# EAGLE design mainboard_hole_din_pa1 (EAGLE 4.11)
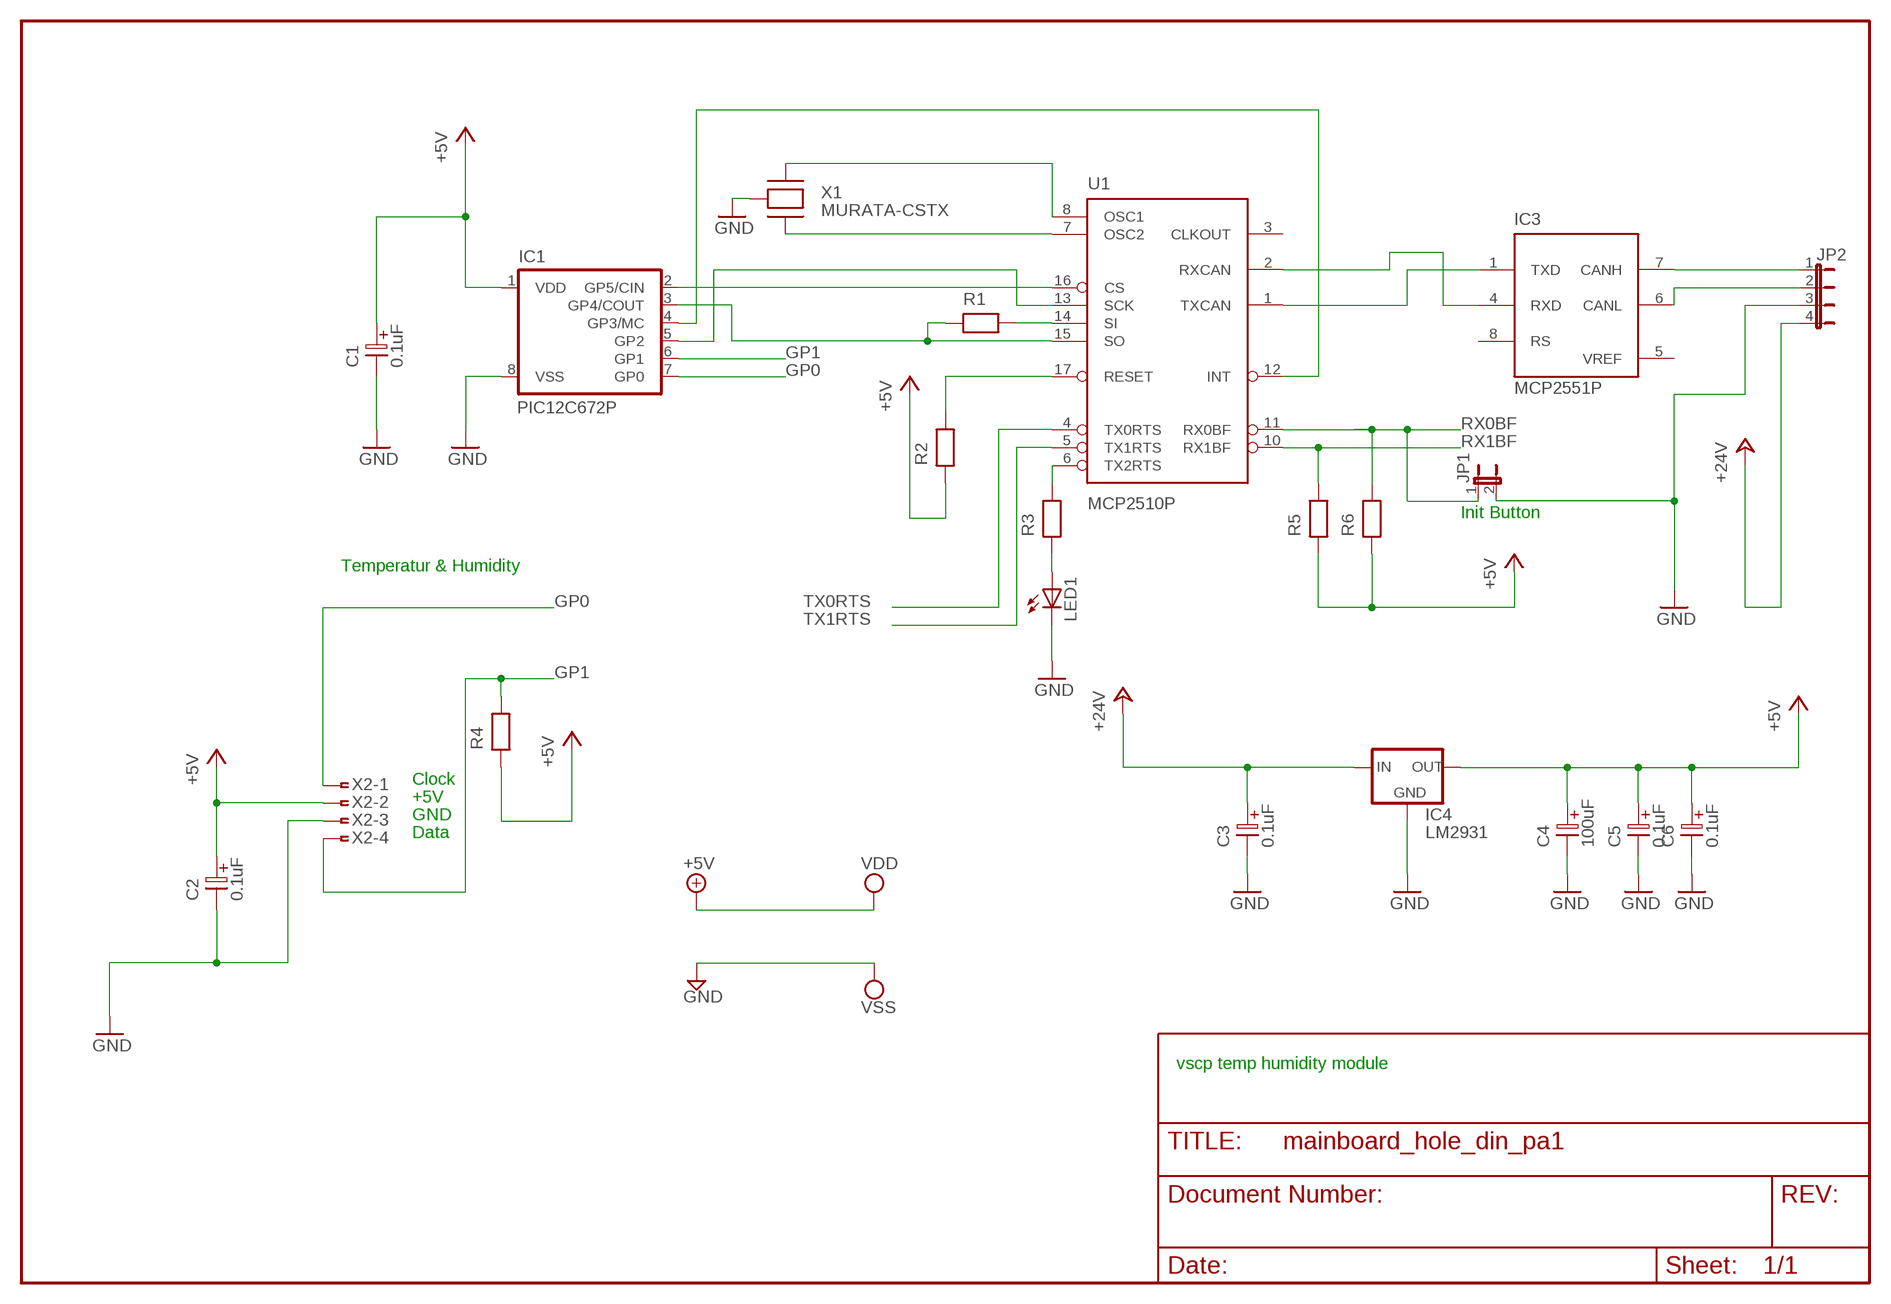
[diagram p0: schematic, sheet 1]

## Parts
C1  0.1uF  ELC-2,5  [ES-2,5]
C2  0.1uF  ELC-2,5  [ES-2,5]
C3  0.1uF  ELC-2,5  [ES-2,5]
C4  100uF  ELC-5  [ES-5]
C5  0.1uF  ELC-2,5  [ES-2,5]
C6  0.1uF  ELC-2,5  [ES-2,5]
IC1  PIC12C672P  [DIL8]
IC3  MCP2551P  [DIL8]
IC4  LM2931  78LXX  [78LXX]
JP1  JP1E  [JP1]
JP2  JP4E  [JP4]
LED1  LED3MM  [LED3MM]
R1  RESEU-5  [R-5]
R2  RESEU-5  [R-5]
R3  RESEU-5  [R-5]
R4  RESEU-5  [R-5]
R5  RESEU-5  [R-5]
R6  RESEU-5  [R-5]
U1  MCP2510P  [DIL18]
X1  MURATA-CSTX  [RESONATOR-MURATA]
X2  FTOP-4  [FTOP-4]

## Nets
+5V: C1.1 C2.1 C4.1 C5.1 C6.1 IC1.1(VDD) IC4.OUT R2.1 R4.1 R5.1 R6.1 X2.2 ; supply symbol labelled VDD
+24V: C3.1 IC4.IN JP2.4
CANH: IC3.7(CANH) JP2.1
CANL: IC3.6(CANL) JP2.2
GND: C1.2 C2.2 C3.2 C4.2 C5.2 C6.2 IC1.8(VSS) IC4.GND JP1.2 JP2.3 LED1.K(C) X1.2(GND) X2.3 ; supply symbol labelled VSS
GP0: IC1.7(GP0) X2.1
GP1: IC1.6(GP1) R4.2 X2.4
GP2: IC1.5(GP2) U1.13(SCK)
GP3: IC1.4(GP3/MC) U1.12(INT)
GP4: IC1.3(GP4/COUT) R1.1 U1.15(SO)
GP5: IC1.2(GP5/CIN) U1.16(CS)
N$3: R2.2 U1.17(RESET)
N$7: R1.2 U1.14(SI)
N$10: LED1.A R3.1
OSC1: U1.8(OSC1) X1.1(XTIN)
OSC2: U1.7(OSC2) X1.3(XTOUT)
RX0BF: JP1.1 R6.2 U1.11(RX0BF)
RX1BF: R5.2 U1.10(RX1BF)
RXCAN: IC3.4(RXD) U1.2(RXCAN)
TX0RTS: U1.4(TX0RTS)
TX1RTS: U1.5(TX1RTS)
TX2RTS: R3.2 U1.6(TX2RTS)
TXCAN: IC3.1(TXD) U1.1(TXCAN)
Unconnected: IC3.8(RS) U1.3(CLKOUT)

## Notes on the sheet
- Init Button
- Temperatur & Humidity
- Clock
- +5V
- GND
- Data
- vscp temp humidity module

## Power pins joined to a net without a drawn wire
+5V: IC3.3(VDD) U1.18(VDD)
GND: IC3.2(VSS) U1.9(VSS)
VREF: IC3.5(VREF)

## Library data of the parts
C1-C3 C5 C6 = discrete:ELC-2,5
C4 = discrete:ELC-5
IC1 = microchip:PIC12C*?: MICROCONTROLLER
IC3 = microchip_can:MCP2551: High Speed CAN tranceiver
IC4 = v-reg:78LXX: VOLTAGE REGULATOR
JP1 = jumper:JP1E: JUMPER
JP2 = jumper:JP4E: JUMPER
LED1 = led:LED: LED OSRAM: - CHIPLED LG R971, LG N971, LY N971, LG Q971, LY Q971, LO R971, LY R971 LH N974, LH R974 LS Q976, LO Q976, LY Q976 LO Q996 - Hyper CHIPLED LW Q18S LB Q993, LB Q99A, LB R99A - SideLED LS A670, LO A670, LY A670, LG A670, LP A670 LB A673, LV A673, LT A673, LW A673 LH A674 LY A675 LS A676, LA A676, LO A676, LY A676, LW A676 LS A679, LY A679, LG A679 - Hyper Micro SIDELED® LS Y876, LA Y876, LO Y876, LY Y876 LT Y87S - SmartLED LW L88C, LW L88S LB L89C, LB L89S, LG L890 LS L89K, LO L89K, LY L89K LS L896, LA L896, LO L896, LY L896 - TOPLED LS T670, LO T670, LY T670, LG T670, LP T670 LSG T670, LSP T670, LSY T670, LOP T670, LYG T670 LG T671, LOG T671, LSG T671 LB T673, LV T673, LT T673, LW T673 LH T674 LS T676, LA T676, LO T676, LY T676, LB T676, LH T676, LSB T676, LW T676 LB T67C, LV T67C, LT T67C, LS T67K, LO T67K, LY T67K, LW E67C LS E67B, LA E67B, LO E67B, LY E67B, LB E67C, LV E67C, LT E67C LW T67C LS T679, LY T679, LG T679 LS T770, LO T770, LY T770, LG T770, LP T770 LB T773, LV T773, LT T773, LW T773 LH T774 LS E675, LA E675, LY E675, LS T675 LS T776, LA T776, LO T776, LY T776, LB T776 LHGB T686 LT T68C, LB T68C - Hyper Mini TOPLED® LB M676 - Mini TOPLED Santana® LG M470 LS M47K, LO M47K, LY M47K Source: http://www.osram.convergy.de/
R1-R6 = discrete:RESEU-5
U1 = microchip_can:MCP2510
X1 = eurosource_ftdi:MURATA-CSTX
X2 = con-amp:FTOP-4: AMP connector

## Board
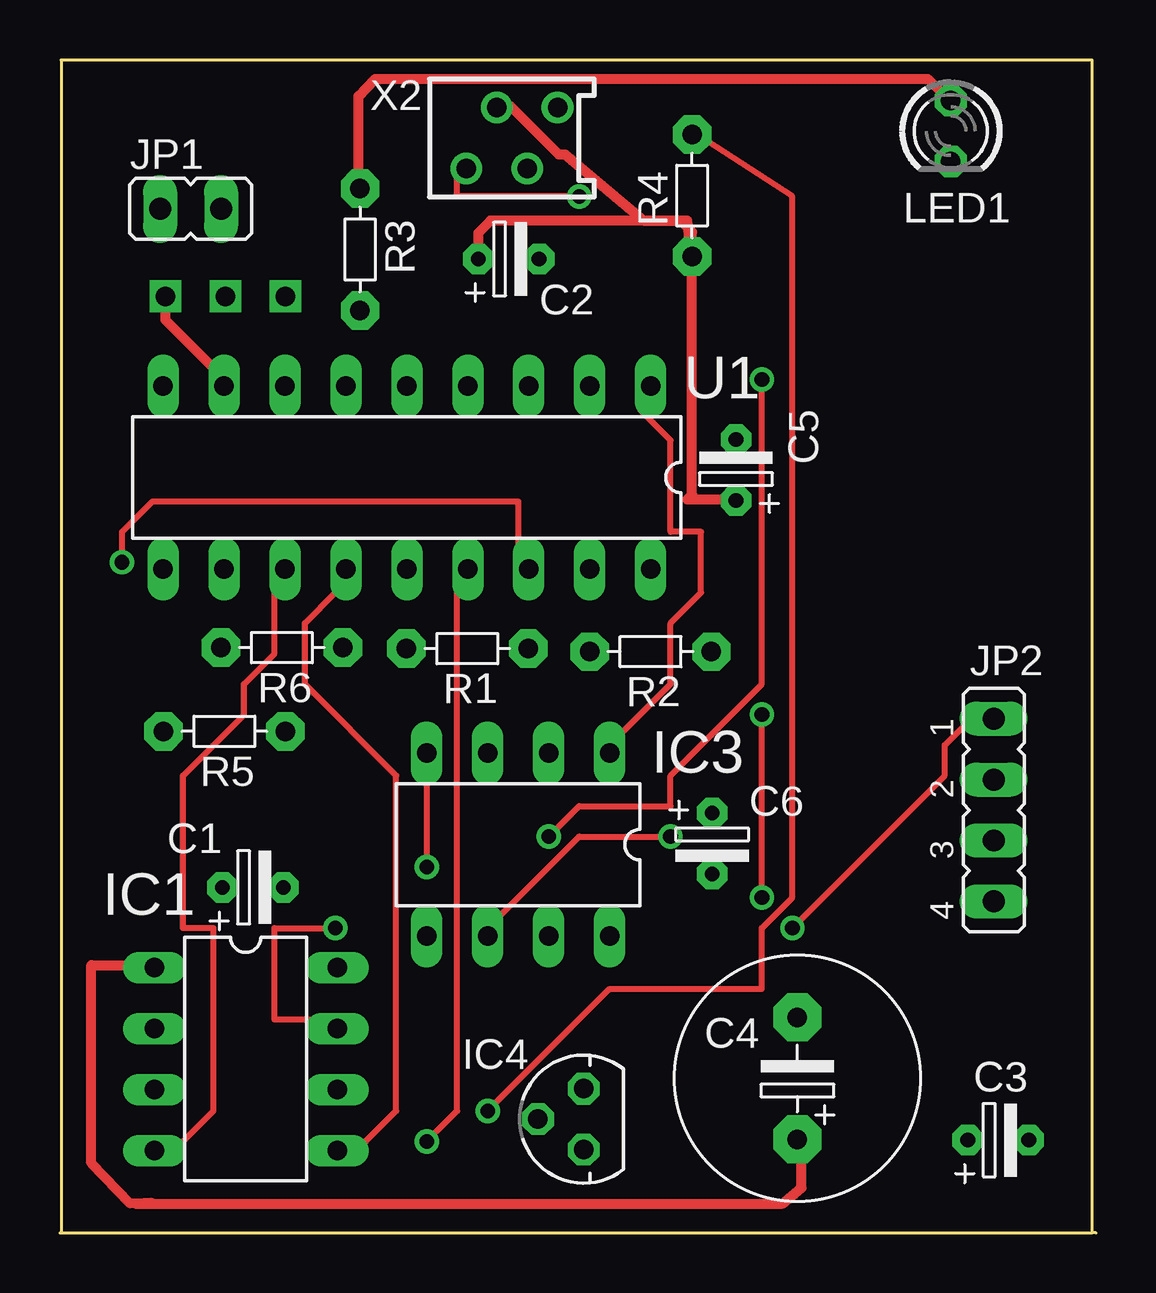
[diagram p1: board, top side]
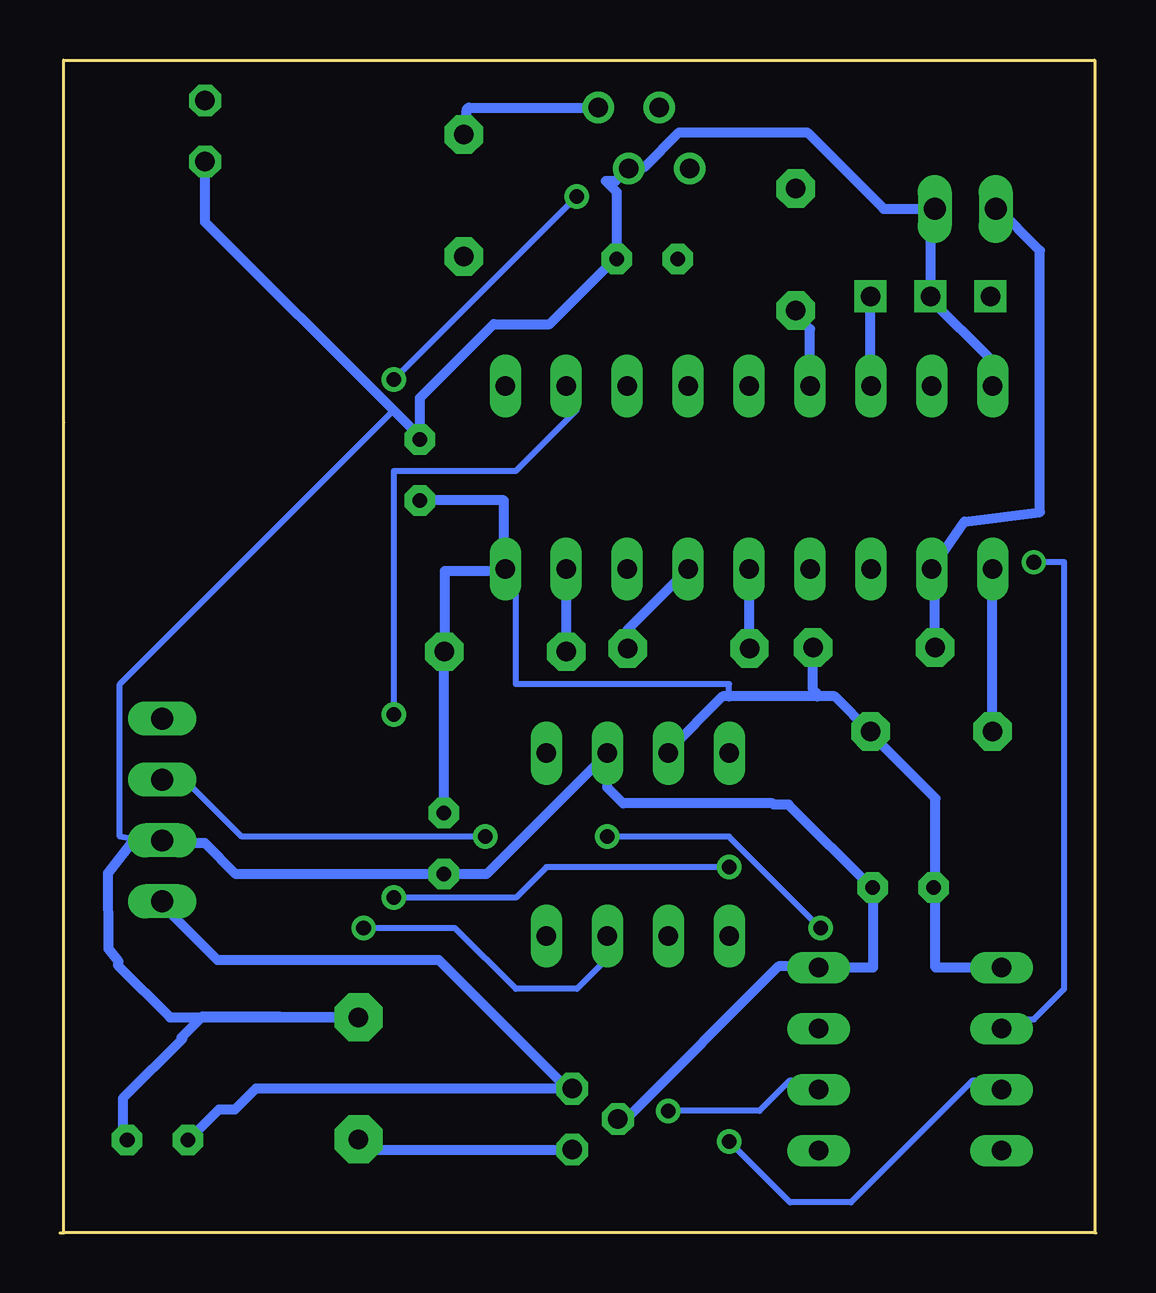
[diagram p2: board, bottom side, seen from below]

Size 43.18 x 48.87 mm. Coordinates in mm from the lower left corner, seen from the top.
Copper layers (1*16): Top 0.0254mm / dielectric 1.4986mm / Bottom 0.0254mm
Design rules "default": minimum track width 10mil, minimum drill 24mil, track to track 8mil, track to pad 8mil, pad to pad 8mil, via to via 8mil, smd to smd 8mil, copper to edge 40mil, drill to drill 8mil, minimum pad ring 10mil, minimum via ring 8mil, stop-mask expansion 4mil, vias tented up to drill 0mil, thermal gap 10mil

### Footprints (pad centres in the part's own frame; a part is rotated, then mirrored left to right if it is on the bottom)
ES-2,5 = drill 0.61 pad 1.27 octagon: 1 -1.27,0; 2 1.27,0
ES-5 = drill 0.813 pad 2.007 octagon: 1 -2.54,0; 2 2.54,0
DIL8 = drill 0.813 long: 1 -3.81,-3.81; 2 -1.27,-3.81; 3 1.27,-3.81; 4 3.81,-3.81; 5 3.81,3.81; 6 1.27,3.81; 7 -1.27,3.81; 8 -3.81,3.81
78LXX = drill 0.813 octagon: GND 0,1.905; IN 1.27,0; OUT -1.27,0
JP1 = drill 0.914 long: 1 0,-1.27; 2 0,1.27
JP4 = drill 0.914 long: 1 -3.81,0; 2 -1.27,0; 3 1.27,0; 4 3.81,0
LED3MM = drill 0.813 octagon: A -1.27,0; K 1.27,0
R-5 = drill 0.813 pad 1.6 octagon: 1 -2.54,0; 2 2.54,0
DIL18 = drill 0.813 long: 1 -10.16,-3.81; 2 -7.62,-3.81; 3 -5.08,-3.81; 4 -2.54,-3.81; 5 0,-3.81; 6 2.54,-3.81; 7 5.08,-3.81; 8 7.62,-3.81; 9 10.16,-3.81; 10 10.16,3.81; 11 7.62,3.81; 12 5.08,3.81; 13 2.54,3.81; 14 0,3.81; 15 -2.54,3.81; 16 -5.08,3.81; 17 -7.62,3.81; 18 -10.16,3.81
RESONATOR-MURATA = drill 0.813 square: 1 0,0; 2 2.5,0; 3 5,0
FTOP-4 = drill 0.813 round: 1 -1.905,-1.27; 2 -0.635,1.27; 3 0.635,-1.27; 4 1.905,1.27

### Placement (x,y rotation side)
C1  8.04,14.39 0 top
C2  18.7,40.57 0 top
C3  39.11,3.86 0 top
C4  30.74,6.44 90 top
C5  28.18,31.79 90 top
C6  27.19,16.22 270 top
IC1  7.74,7.24 270 top
IC3  19.1,16.18 180 top
IC4  21.83,4.74 90 top
JP1  5.45,42.66 270 top
JP2  38.92,17.62 270 top
LED1  37.13,45.9 270 top
R1  16.98,24.35 180 top
R2  24.62,24.21 180 top
R3  12.51,40.97 270 top
R4  26.35,43.22 90 top
R5  6.86,20.89 180 top
R6  9.25,24.38 180 top
U1  14.46,31.47 180 top
U$1  [DIN_SIMPLE]  0.05,0 0 top
X1  4.4,39.02 0 top
X2  18.84,45.62 0 top

### Tracks (layer width: path | path; a pad name or v marks a point on that pad's centre or on a via)
+5V  (via drill 0.61)
  Top 0.406: v30.74,3.97 v30.74,3.96 30.91,3.79 30.91,1.87 30.12,1.22 3.15,1.22 3.82,1.25 2.91,1.24 1.31,2.9 1.31,11.15 3.99,11.15 4.04,11.1 3.99,11.05 IC1.1 | C2.1 17.43,41.66 17.95,42.17 25.57,42.17 26.14,42.17 | 26.14,42.17 26.2,41.61 R4.1 | 24.32,42.17 26.14,42.17 | 24.32,42.17 21.06,44.92 20.8,44.92 18.77,46.94 18,46.94 18.05,46.89 X2.2 | 24.32,42.17 25.88,42.17 26.35,41.7 26.35,30.76 26.14,30.55 28.06,30.55 28.16,30.45 28.18,30.46 C5.1
  Bottom 0.254: 24.68,27.57 24.18,27.94 U1.18 24.18,26.67 24.18,22.86 15.29,22.86 15.29,22.36
  Bottom 0.406: C5.1 24.68,30.52 24.68,27.57 27.14,27.57 27.14,24.21 | 27.14,24.21 27.14,24.12 | 27.14,24.21 R2.1 27.14,24.21 | 6.69,14.39 C1.1 | IC1.1 6.69,11.05 6.69,14.39 | v30.74,3.97 30.76,3.99 | v30.74,3.97 C4.1 | IC4.OUT 30.23,3.47 v30.74,3.97 | 27.14,24.21 27.13,24.22 | C6.1 27.19,24.16 27.14,24.21 | 6.69,14.39 6.69,18.1 9.44,20.85 R5.1 9.39,20.86 | IC3.3 17.83,20.09 15.56,22.36 15.29,22.36 11.62,22.36 | 9.39,20.86 9.39,20.85 | 11.62,22.36 10.89,22.36 9.39,20.86 | 11.62,22.36 11.62,22.46 11.79,22.64 R6.1
+24V
  Bottom 0.406: C3.1 37.92,3.79 | C3.1 | C3.1 36.57,5.13 35.89,5.13 35.02,6.01 IC4.IN 22.03,6.01 27.39,11.36 36.62,11.36 39.07,13.81 | 39.07,13.81 39.11,13.85 | 39.07,13.81 JP2.4
CANH  (via drill 0.61)
  Top 0.254: v30.53,12.7 36.88,19.05 36.88,20.32 38.15,21.59 JP2.1
  Bottom 0.254: v30.53,12.7 26.72,12.7 24.18,10.16 21.64,10.16 20.37,11.43 IC3.7
CANL  (via drill 0.61)
  Top 0.254: v25.45,16.51 21.64,16.51 17.83,12.7 IC3.6
  Bottom 0.254: v25.45,16.51 35.61,16.51 38.15,19.05 JP2.2
GND
  Bottom 0.254: 29.26,34.29 29.28,34.27 40.69,22.86 40.69,16.51 40.09,16.39
  Bottom 0.406: 9.28,14.39 9.28,14.52 | 9.28,14.39 C1.2 9.31,14.34 | 9.28,14.39 9.28,11.05 IC1.8 11.62,11.05 11.67,11.1 13.22,11.1 19.59,4.74 IC4.GND | 9.31,14.34 9.18,14.21 | 9.31,14.34 12.81,17.84 13.43,17.84 13.48,17.89 19.71,17.89 20.37,18.55 IC3.2 | C3.2 40.49,3.86 40.51,3.84 40.56,3.89 40.56,5.6 38.07,8.09 38.13,8.13 37.24,9.01 C4.2 38.59,8.98 40.77,11.15 40.75,11.31 41.17,11.83 41.18,14.99 40.09,16.39 38.95,16.39 38.91,16.35 | 38.91,16.35 38.85,16.29 | 38.91,16.35 JP2.3 39.05,16.35 39.06,16.34 38.95,16.23 37.14,16.23 35.85,14.95 C6.2 25.41,14.95 IC3.2 | IC3.2 20.28,20.07 | U1.9 4.3,36.31 7,39.01 6.99,39.02 X1.2 6.9,42.38 6.64,42.64 6.66,42.66 JP1.2 8.84,42.66 12.03,45.85 17.38,45.85 18.83,44.4 19.45,44.4 | LED1.K 37.13,42.11 29.28,34.27 28.18,33.16 C5.2 28.18,34.79 25.1,37.87 22.77,37.87 20.02,40.61 C2.2 19.97,43.37 20.43,43.83 20.02,43.83 19.45,44.4 | 19.45,44.4 19.47,44.38 X2.3
GP0  (via drill 0.61)
  Top 0.254: v11.48,12.7 8.94,12.7 8.94,8.89 11.48,8.89 IC1.7 | v20.37,16.51 21.64,17.78 25.45,17.78 25.45,19.05 29.26,22.86 v29.26,35.56 | v21.64,43.18 16.56,43.18 16.56,44.45 X2.1
  Bottom 0.254: v11.48,12.7 15.29,16.51 v20.37,16.51 | v29.26,35.56 v21.64,43.18
GP1  (via drill 0.61)
  Top 0.254: v17.83,5.08 22.91,10.16 29.26,10.16 29.26,12.7 30.53,13.97 30.53,43.18 26.29,45.95 R4.2
  Bottom 0.254: v17.83,5.08 14.02,5.08 12.75,6.35 IC1.6
  Bottom 0.406: R4.2 26.2,46.85 26.19,46.84 26.15,46.89 X2.4
GP2
  Top 0.254: IC1.5 12.75,3.81 14.02,5.08 14.02,19.05 10.21,22.86 10.21,25.4 11.48,26.67 U1.13
GP3
  Top 0.254: IC1.4 5.13,3.81 6.4,5.08 6.4,12.7 5.13,12.7 5.13,19.05 7.67,21.59 7.67,22.86 8.94,24.13 8.94,26.67 U1.12
GP4  (via drill 0.61)
  Top 0.254: v15.29,3.81 16.56,5.08 16.56,26.67 U1.15
  Bottom 0.254: v15.29,3.81 12.75,1.27 10.21,1.27 5.13,6.35 IC1.3
  Bottom 0.406: U1.15 19.52,25.14 R1.1
GP5  (via drill 0.61)
  Top 0.254: v2.59,27.94 2.59,29.21 3.86,30.48 19.1,30.48 19.1,27.94 U1.16
  Bottom 0.254: v2.59,27.94 1.32,27.94 1.32,10.16 2.59,8.89 3.86,8.89 IC1.2
N$3
  Bottom 0.406: 22.08,27.68 22.15,27.75 | 22.08,27.68 U1.17 | R2.2 22.08,27.68
N$7
  Bottom 0.406: 14.44,27.73 14.46,27.71 U1.14 | R1.2 14.44,27.73 | 14.44,27.73 14.37,27.8
N$10
  Top 0.406: R3.1 12.49,43.51 12.45,43.47 12.45,47.36 13.14,48.08 36.17,48.08 37.13,47.16 | 37.13,47.16 37.19,47.1 | 37.13,47.16 LED1.A
OSC1
  Top 0.406: U1.8 6.86,35.28 7,35.43 4.4,38.03 X1.1
OSC2
  Bottom 0.406: U1.7 9.38,35.37 9.4,35.39 X1.3
RX0BF
  Bottom 0.406: R6.2 6.71,27.51 6.84,27.64 U1.11 5.48,29.63 2.33,30.03 2.33,40.92 4.18,42.77 | 4.18,42.77 4.2,42.79 | 4.18,42.77 JP1.1
RX1BF
  Bottom 0.406: 4.32,27.66 4.35,27.7 | 4.32,27.66 U1.10 | R5.2 4.32,27.66
RXCAN  (via drill 0.61)
  Top 0.254: v15.29,15.24 15.29,19.05 IC3.4 | v29.26,13.97 v29.26,21.59
  Bottom 0.254: v15.29,15.24 22.91,15.24 24.18,13.97 v29.26,13.97 | v29.26,21.59 29.26,31.75 24.18,31.75 21.64,34.29 U1.2
TX2RTS
  Bottom 0.406: R3.2 12.61,38.43 12.65,38.38 11.92,37.65 U1.6
TXCAN
  Top 0.254: IC3.1 22.91,20.32 25.45,22.86 25.45,25.4 26.72,26.67 26.72,29.21 25.45,29.21 25.45,33.02 24.18,34.29 U1.1